# Altium schematic sheet VariableStoboscope_Rev1.0.SchDoc
size A4
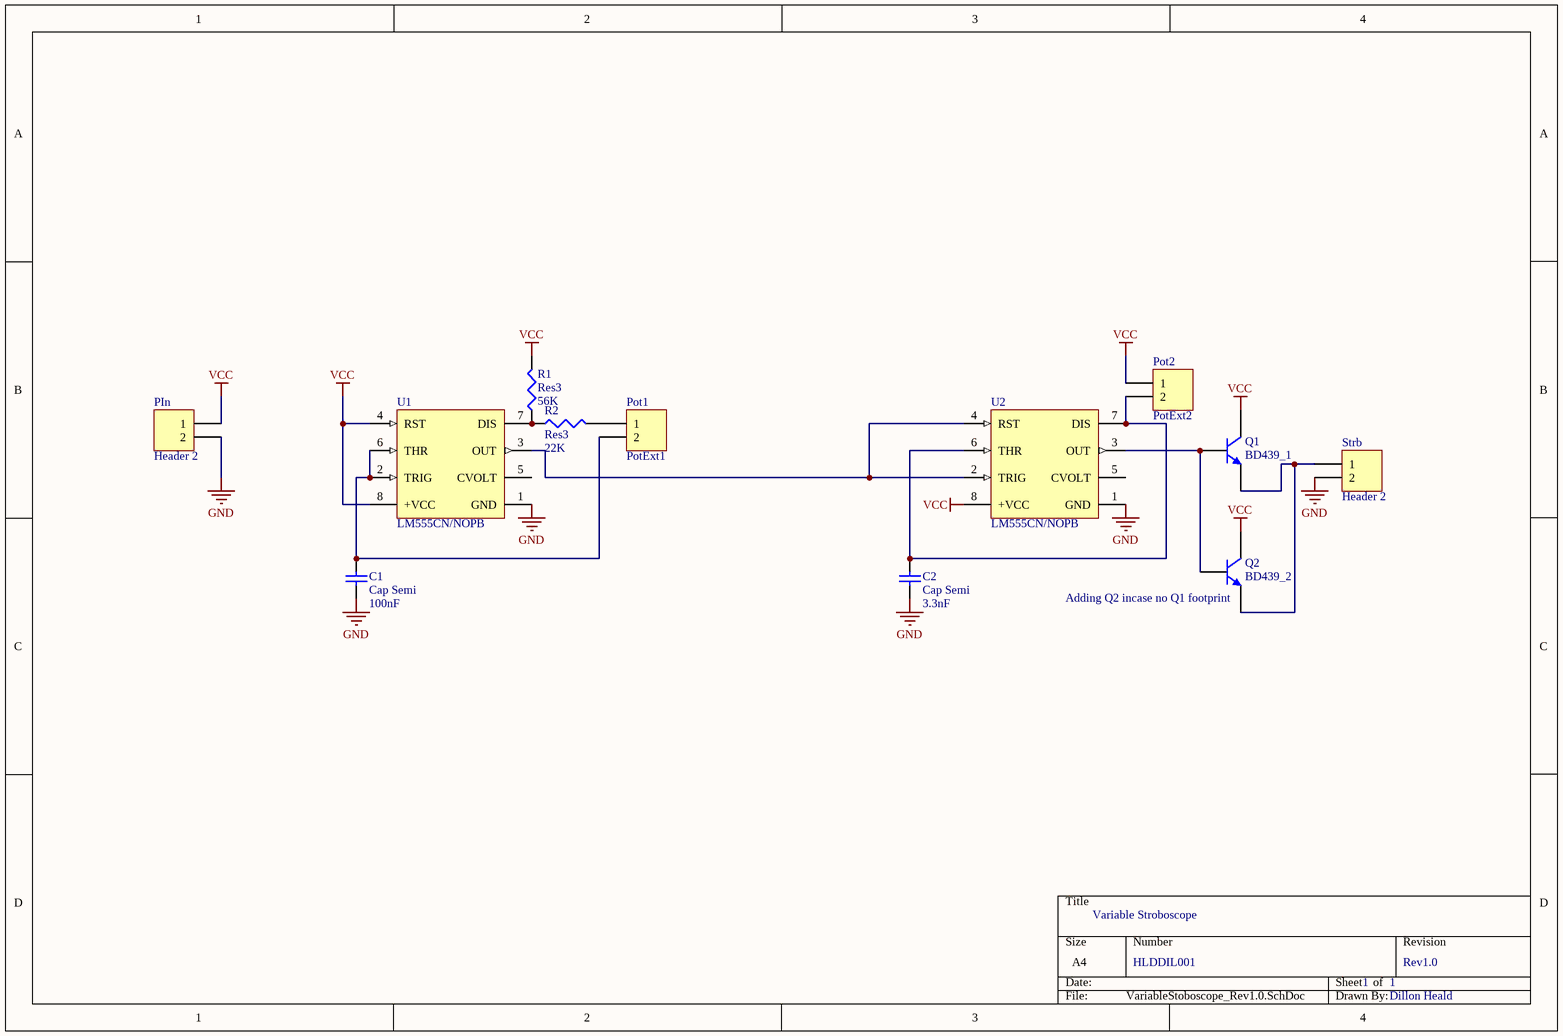
[diagram p0: VariableStoboscope_Rev1.0.SchDoc]

## Parts
C1  Cap Semi  value 100nF  [C1206]
C2  Cap Semi  value 3.3nF  [C1206]
PIn  Header 2  [HDR1X2]
Pot1  PotExt1  [HDR1X2]
Pot2  PotExt2  [HDR1X2]
Q1  BD439_1  [SOT-23B_M]
Q2  BD439_2  [TO-226-AA]
R1  Res3  value 56K  [J1-0603]
R2  Res3  value 22K  [J1-0603]
Strb  Header 2  [HDR1X2]
U1  LM555CN/NOPB  [N08E]
U2  LM555CN/NOPB  [N08E]

## Nets
GND: C1.1 C2.1 PIn.2 Strb.2 U1.1(GND) U2.1(GND)
VCC: PIn.1 Pot2.1 Q1.1(C) Q2.1(C) R1.2 U1.4(RST) U1.8(+VCC) U2.8(+VCC)
NetC1_2: C1.2 Pot1.2 U1.2(TRIG) U1.6(THR)
NetC2_2: C2.2 Pot2.2 U2.6(THR) U2.7(DIS)
NetPot1_1: Pot1.1 R2.2
NetQ1_2: Q1.2(B) Q2.2(B) U2.3(OUT)
NetQ1_3: Q1.3(E) Q2.3(E) Strb.1
NetR1_1: R1.1 R2.1 U1.7(DIS)
NetU1_3: U1.3(OUT) U2.2(TRIG) U2.4(RST)

Not connected (* = marked no-connect by the designer): U1 5(CVOLT); U2 5(CVOLT)

## Notes on the sheet
- (near Q2) Adding Q2 incase no Q1 footprint
- Variable Stroboscope
- HLDDIL001
- 1
- Rev1.0
- Dillon Heald

## Library data of the parts
C1 C2 = Cap Semi: Capacitor (Semiconductor SIM Model); Published: 8-Jun-2000; LatestRevisionDate: 29-May-2009; LatestRevisionNote: IPC-7351 Footprint Added.; PackageReference: C1206; Publisher: Altium Limited; PackageDescription: Chip Capacitor
PIn Pot1 Pot2 Strb = Header 2: Header, 2-Pin; LatestRevisionDate: 17-Jul-2002; LatestRevisionNote: Re-released for DXP Platform.; Publisher: Altium Limited
Q1 = QNPN: NPN Bipolar Transistor; Published: 8-Jun-2000; LatestRevisionDate: 29-May-2009; LatestRevisionNote: IPC-7351 Footprint Added.; PackageVersion: Aug-1999; PackageReference: SOT-23B; Publisher: Altium Limited; PackageDescription: 3-Pin SOT-23 Package 0.95 mm Pitch, 2.4 mm Lead Span
Q2 = NPN: NPN Bipolar Transistor; Published: 8-Jun-2000; LatestRevisionDate: 17-Jul-2002; LatestRevisionNote: Re-released for DXP Platform.; PackageReference: TO-226-AA; Publisher: Altium Limited; PackageDescription: TO, Flat Index; 3 In-Line, Axial Leads; Body Dia. 4.8mm; Leads 0.55 x 0.51 mm (max); Code_JEDEC: TO-226-AA
R1 R2 = Res3: Resistor; Published: 8-Jun-2000; LatestRevisionDate: 29-May-2009; LatestRevisionNote: IPC-7351 Footprint Added.; PackageReference: J1-0603; Publisher: Altium Limited; PackageDescription: Chip Resistor
U1 U2 = CMP-0056-00016-2: Timer, 8-pin MDIP, Pb-Free; Manufacturer: National Semiconductor; CompType: Analog IC; PowerWise: N; PackageTopMarking: NSUZXYTTE#*LM*555CN; ComponentLink3Description: N08E Package Page; ComponentLink3URL: http://www.national.com/packaging/folders/n08e.html; ComponentLink1URL: http://www.national.com/ds/LM/LM555.pdf; PackageVersion: revG, May-2006; PackageDescription: MDIP, .365 x .250 x .130in, 8 Lead, .100in Pitch; ComponentLink1Description: LM555 Datasheet; RevisionNote: Component URLs added; ComponentLink2URL: http://www.national.com/pf/LM/LM555.html; RoHS: Y; Code_JEDEC: MS-001-BA; DatasheetVersion: Jul-2006; PackageReference: N08E; PinCount: 8; ComponentLink2Description: LM555 Web Page